# Altium schematic sheet QCLogic Rev A Sht4 QSPI Flash.SchDoc
size A4
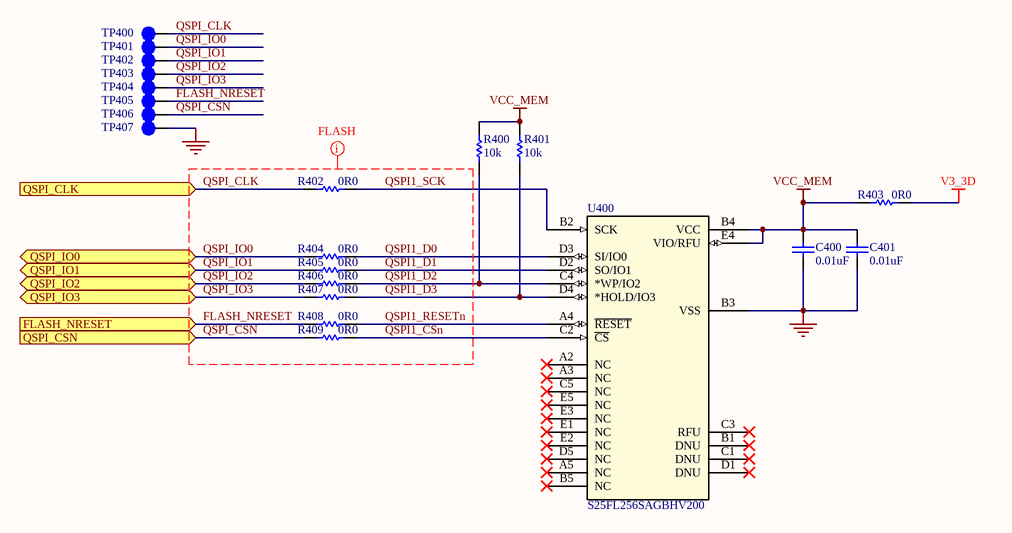
[diagram p0: QCLogic Rev A Sht4 QSPI Flash.SchDoc]

## Parts
C400  0.01uF  [SMD CAP 0402]
C401  0.01uF  [SMD CAP 0402]
R400  10k  [SMD RES 0402]
R401  10k  [SMD RES 0402]
R402  0R0  [SMD RES 0402]
R403  0R0  [SMD RES 0402]
R404  0R0  [SMD RES 0402]
R405  0R0  [SMD RES 0402]
R406  0R0  [SMD RES 0402]
R407  0R0  [SMD RES 0402]
R408  0R0  [SMD RES 0402]
R409  0R0  [SMD RES 0402]
TP400  TESTPOINT SMD  [TESTPOINT 0.5mm DIA]  (value not drawn)  (no BOM)
TP401  TESTPOINT SMD  [TESTPOINT 0.5mm DIA]  (value not drawn)  (no BOM)
TP402  TESTPOINT SMD  [TESTPOINT 0.5mm DIA]  (value not drawn)  (no BOM)
TP403  TESTPOINT SMD  [TESTPOINT 0.5mm DIA]  (value not drawn)  (no BOM)
TP404  TESTPOINT SMD  [TESTPOINT 0.5mm DIA]  (value not drawn)  (no BOM)
TP405  TESTPOINT SMD  [TESTPOINT 0.5mm DIA]  (value not drawn)  (no BOM)
TP406  TESTPOINT SMD  [TESTPOINT 0.5mm DIA]  (value not drawn)  (no BOM)
TP407  TESTPOINT SMD  [TESTPOINT 0.5mm DIA]  (value not drawn)  (no BOM)
U400  S25FL256SAGBHV200  [TFBGA-24 8x6]

## Ports
FLASH_NRESET (in), QSPI_CLK (in), QSPI_CSN (in), QSPI_IO0 (bidir), QSPI_IO1 (bidir), QSPI_IO2 (bidir), QSPI_IO3 (bidir)

## Nets
GND: C400.2 C401.2 TP407.1 U400.B3(VSS)
V3_3D: R403.2
VCC_MEM: C400.1 C401.1 R400.1 R401.1 R403.1 U400.B4(VCC) U400.E4(VIO/RFU)
FLASH_NRESET: R408.1 TP405.1 ; port FLASH_NRESET
QSPI1_CSn: R409.2 U400.C2(~{CS})
QSPI1_D0: R404.2 U400.D3(SI/IO0)
QSPI1_D1: R405.2 U400.D2(SO/IO1)
QSPI1_D2: R400.2 R406.2 U400.C4(*WP/IO2)
QSPI1_D3: R401.2 R407.2 U400.D4(*HOLD/IO3)
QSPI1_RESETn: R408.2 U400.A4(~{RESET})
QSPI1_SCK: R402.2 U400.B2(SCK)
QSPI_CLK: R402.1 TP400.1 ; port QSPI_CLK
QSPI_CSN: R409.1 TP406.1 ; port QSPI_CSN
QSPI_IO0: R404.1 TP401.1 ; port QSPI_IO0
QSPI_IO1: R405.1 TP402.1 ; port QSPI_IO1
QSPI_IO2: R406.1 TP403.1 ; port QSPI_IO2
QSPI_IO3: R407.1 TP404.1 ; port QSPI_IO3

Not connected (* = marked no-connect by the designer): U400 A2(NC)* A3(NC)* A5(NC)* B1(DNU)* B5(NC)* C1(DNU)* C3(RFU)* C5(NC)* D1(DNU)* D5(NC)* E1(NC)* E2(NC)* E3(NC)* E5(NC)*

## Layout directives
net class FLASH: FLASH_NRESET, QSPI1_CSn, QSPI1_D0, QSPI1_D1, QSPI1_D2, QSPI1_D3, QSPI1_RESETn, QSPI1_SCK, QSPI_CLK, QSPI_CSN, QSPI_IO0, QSPI_IO1, QSPI_IO2, QSPI_IO3

## Library data of the parts
C400 C401 = CAP MLCC SMD: CAP CER 10000PF 16V X7R 0402; 1. Manufacturer: Walsin Technology Corporation; 2. Manufacturer Part Number: 0402B103K160CT; 4. Package: 0402; 3. Date Modified: 20201122
R400 R401 = RES SMD: RES SMD 10K OHM 1% 1/16W 0402; 1. Manufacturer: Yageo; 2. Manufacturer Part Number: RC0402FR-0710KL; 4. Package: 0402; 3. Date Modified: 20201126
R402-R409 = RES SMD: RES SMD 0 OHM JUMPER 1/16W 0402; 1. Manufacturer: Yageo; 2. Manufacturer Part Number: RC0402FR-070RL; 4. Package: 0402; 3. Date Modified: 20201122
TP400-TP407 = TESTPOINT PAD: TESTPOINT SMD PAD; 1. Manufacturer: *; 2. Manufacturer Part Number: *; 3. Date Modified: *
U400 = IC FLASH 256M SPI 133MHZ 24BGA: 1. Manufacturer: Cypress Semiconductor Corp; 2. Manufacturer Part Number: S25FL256SAGBHV200; 3. Date Modified: 20200909